# Altium schematic sheet A7_FUNCTION1 -2.SchDoc
size A3
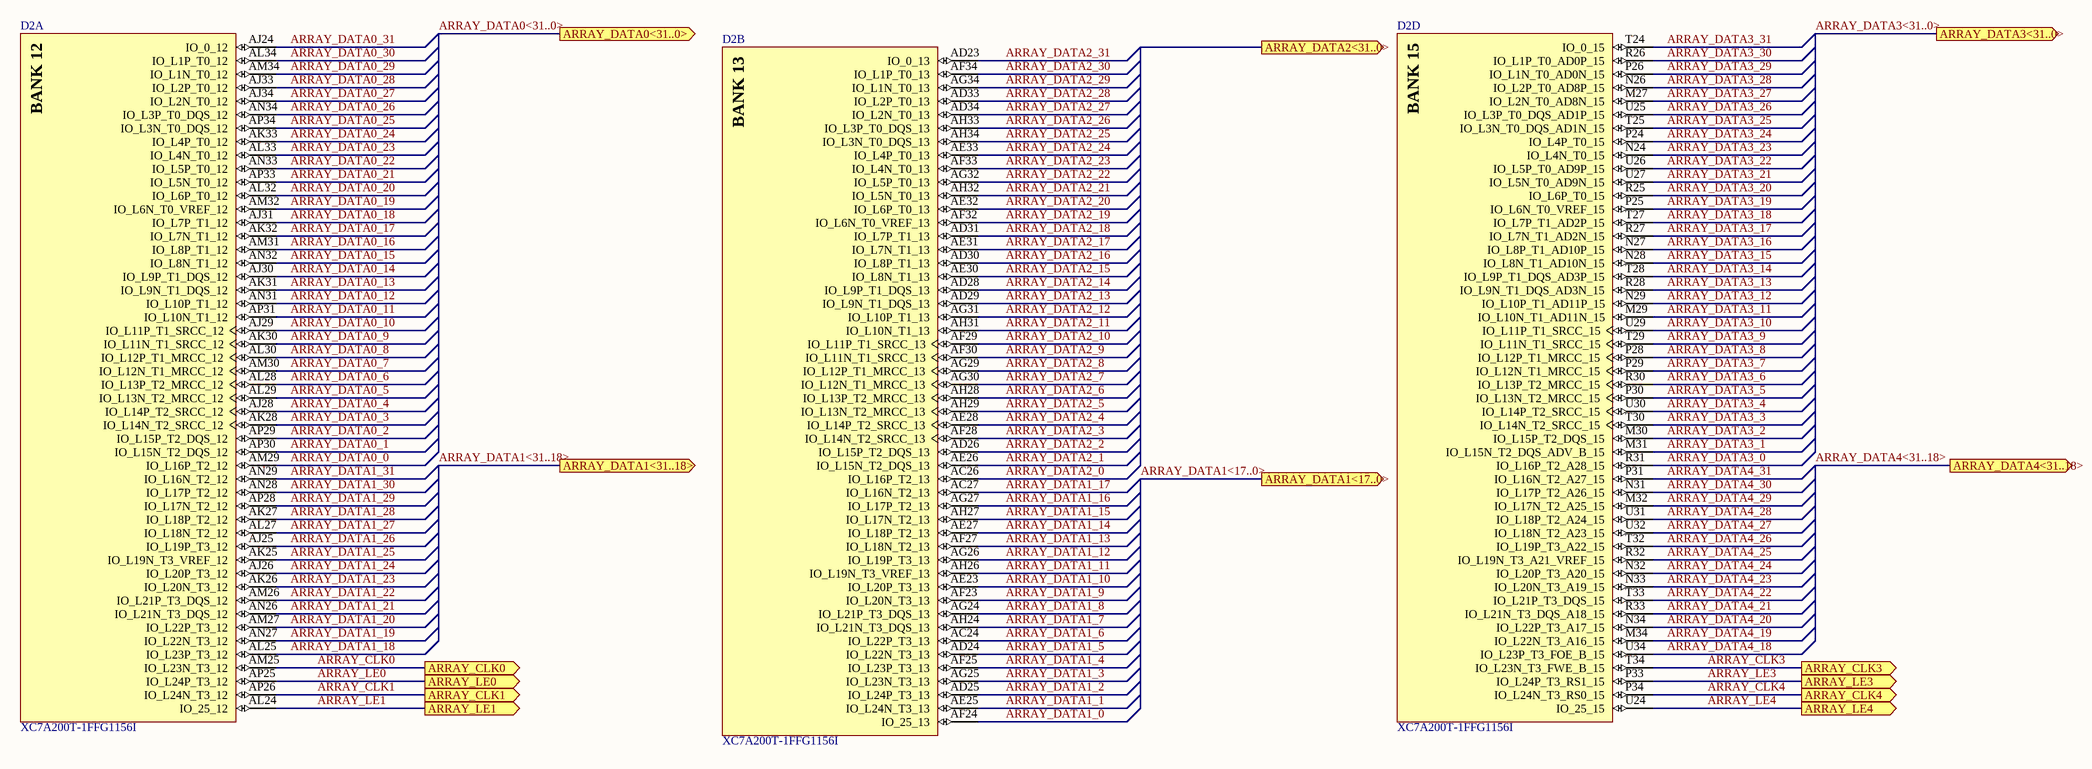
[diagram p0: A7_FUNCTION1 -2.SchDoc]

## Parts
D2  XC7A200T-1FFG1156I  [FFG1156]  (parts A,B,D of 18)

## Ports
ARRAY_CLK0 (out), ARRAY_CLK1 (out), ARRAY_CLK3 (out), ARRAY_CLK4 (out), ARRAY_DATA0<31..0> (out), ARRAY_DATA1<17..0> (out), ARRAY_DATA1<31..18> (out), ARRAY_DATA2<31..0> (out), ARRAY_DATA3<31..0> (out), ARRAY_DATA4<31..18> (out), ARRAY_LE0 (out), ARRAY_LE1 (out), ARRAY_LE3 (out), ARRAY_LE4 (out)

## Nets
ARRAY_CLK0: D2.AM25(IO_L23N_T3_12) ; port ARRAY_CLK0
ARRAY_CLK1: D2.AP26(IO_L24N_T3_12) ; port ARRAY_CLK1
ARRAY_CLK3: D2.T34(IO_L23N_T3_FWE_B_15) ; port ARRAY_CLK3
ARRAY_CLK4: D2.P34(IO_L24N_T3_RS0_15) ; port ARRAY_CLK4
ARRAY_DATA0_0: D2.AM29(IO_L16P_T2_12)
ARRAY_DATA0_1: D2.AP30(IO_L15N_T2_DQS_12)
ARRAY_DATA0_2: D2.AP29(IO_L15P_T2_DQS_12)
ARRAY_DATA0_3: D2.AK28(IO_L14N_T2_SRCC_12)
ARRAY_DATA0_4: D2.AJ28(IO_L14P_T2_SRCC_12)
ARRAY_DATA0_5: D2.AL29(IO_L13N_T2_MRCC_12)
ARRAY_DATA0_6: D2.AL28(IO_L13P_T2_MRCC_12)
ARRAY_DATA0_7: D2.AM30(IO_L12N_T1_MRCC_12)
ARRAY_DATA0_8: D2.AL30(IO_L12P_T1_MRCC_12)
ARRAY_DATA0_9: D2.AK30(IO_L11N_T1_SRCC_12)
ARRAY_DATA0_10: D2.AJ29(IO_L11P_T1_SRCC_12)
ARRAY_DATA0_11: D2.AP31(IO_L10N_T1_12)
ARRAY_DATA0_12: D2.AN31(IO_L10P_T1_12)
ARRAY_DATA0_13: D2.AK31(IO_L9N_T1_DQS_12)
ARRAY_DATA0_14: D2.AJ30(IO_L9P_T1_DQS_12)
ARRAY_DATA0_15: D2.AN32(IO_L8N_T1_12)
ARRAY_DATA0_16: D2.AM31(IO_L8P_T1_12)
ARRAY_DATA0_17: D2.AK32(IO_L7N_T1_12)
ARRAY_DATA0_18: D2.AJ31(IO_L7P_T1_12)
ARRAY_DATA0_19: D2.AM32(IO_L6N_T0_VREF_12)
ARRAY_DATA0_20: D2.AL32(IO_L6P_T0_12)
ARRAY_DATA0_21: D2.AP33(IO_L5N_T0_12)
ARRAY_DATA0_22: D2.AN33(IO_L5P_T0_12)
ARRAY_DATA0_23: D2.AL33(IO_L4N_T0_12)
ARRAY_DATA0_24: D2.AK33(IO_L4P_T0_12)
ARRAY_DATA0_25: D2.AP34(IO_L3N_T0_DQS_12)
ARRAY_DATA0_26: D2.AN34(IO_L3P_T0_DQS_12)
ARRAY_DATA0_27: D2.AJ34(IO_L2N_T0_12)
ARRAY_DATA0_28: D2.AJ33(IO_L2P_T0_12)
ARRAY_DATA0_29: D2.AM34(IO_L1N_T0_12)
ARRAY_DATA0_30: D2.AL34(IO_L1P_T0_12)
ARRAY_DATA0_31: D2.AJ24(IO_0_12)
ARRAY_DATA1_0: D2.AF24(IO_25_13)
ARRAY_DATA1_1: D2.AE25(IO_L24N_T3_13)
ARRAY_DATA1_2: D2.AD25(IO_L24P_T3_13)
ARRAY_DATA1_3: D2.AG25(IO_L23N_T3_13)
ARRAY_DATA1_4: D2.AF25(IO_L23P_T3_13)
ARRAY_DATA1_5: D2.AD24(IO_L22N_T3_13)
ARRAY_DATA1_6: D2.AC24(IO_L22P_T3_13)
ARRAY_DATA1_7: D2.AH24(IO_L21N_T3_DQS_13)
ARRAY_DATA1_8: D2.AG24(IO_L21P_T3_DQS_13)
ARRAY_DATA1_9: D2.AF23(IO_L20N_T3_13)
ARRAY_DATA1_10: D2.AE23(IO_L20P_T3_13)
ARRAY_DATA1_11: D2.AH26(IO_L19N_T3_VREF_13)
ARRAY_DATA1_12: D2.AG26(IO_L19P_T3_13)
ARRAY_DATA1_13: D2.AF27(IO_L18N_T2_13)
ARRAY_DATA1_14: D2.AE27(IO_L18P_T2_13)
ARRAY_DATA1_15: D2.AH27(IO_L17N_T2_13)
ARRAY_DATA1_16: D2.AG27(IO_L17P_T2_13)
ARRAY_DATA1_17: D2.AC27(IO_L16N_T2_13)
ARRAY_DATA1_18: D2.AL25(IO_L23P_T3_12)
ARRAY_DATA1_19: D2.AN27(IO_L22N_T3_12)
ARRAY_DATA1_20: D2.AM27(IO_L22P_T3_12)
ARRAY_DATA1_21: D2.AN26(IO_L21N_T3_DQS_12)
ARRAY_DATA1_22: D2.AM26(IO_L21P_T3_DQS_12)
ARRAY_DATA1_23: D2.AK26(IO_L20N_T3_12)
ARRAY_DATA1_24: D2.AJ26(IO_L20P_T3_12)
ARRAY_DATA1_25: D2.AK25(IO_L19N_T3_VREF_12)
ARRAY_DATA1_26: D2.AJ25(IO_L19P_T3_12)
ARRAY_DATA1_27: D2.AL27(IO_L18N_T2_12)
ARRAY_DATA1_28: D2.AK27(IO_L18P_T2_12)
ARRAY_DATA1_29: D2.AP28(IO_L17N_T2_12)
ARRAY_DATA1_30: D2.AN28(IO_L17P_T2_12)
ARRAY_DATA1_31: D2.AN29(IO_L16N_T2_12)
ARRAY_DATA2_0: D2.AC26(IO_L16P_T2_13)
ARRAY_DATA2_1: D2.AE26(IO_L15N_T2_DQS_13)
ARRAY_DATA2_2: D2.AD26(IO_L15P_T2_DQS_13)
ARRAY_DATA2_3: D2.AF28(IO_L14N_T2_SRCC_13)
ARRAY_DATA2_4: D2.AE28(IO_L14P_T2_SRCC_13)
ARRAY_DATA2_5: D2.AH29(IO_L13N_T2_MRCC_13)
ARRAY_DATA2_6: D2.AH28(IO_L13P_T2_MRCC_13)
ARRAY_DATA2_7: D2.AG30(IO_L12N_T1_MRCC_13)
ARRAY_DATA2_8: D2.AG29(IO_L12P_T1_MRCC_13)
ARRAY_DATA2_9: D2.AF30(IO_L11N_T1_SRCC_13)
ARRAY_DATA2_10: D2.AF29(IO_L11P_T1_SRCC_13)
ARRAY_DATA2_11: D2.AH31(IO_L10N_T1_13)
ARRAY_DATA2_12: D2.AG31(IO_L10P_T1_13)
ARRAY_DATA2_13: D2.AD29(IO_L9N_T1_DQS_13)
ARRAY_DATA2_14: D2.AD28(IO_L9P_T1_DQS_13)
ARRAY_DATA2_15: D2.AE30(IO_L8N_T1_13)
ARRAY_DATA2_16: D2.AD30(IO_L8P_T1_13)
ARRAY_DATA2_17: D2.AE31(IO_L7N_T1_13)
ARRAY_DATA2_18: D2.AD31(IO_L7P_T1_13)
ARRAY_DATA2_19: D2.AF32(IO_L6N_T0_VREF_13)
ARRAY_DATA2_20: D2.AE32(IO_L6P_T0_13)
ARRAY_DATA2_21: D2.AH32(IO_L5N_T0_13)
ARRAY_DATA2_22: D2.AG32(IO_L5P_T0_13)
ARRAY_DATA2_23: D2.AF33(IO_L4N_T0_13)
ARRAY_DATA2_24: D2.AE33(IO_L4P_T0_13)
ARRAY_DATA2_25: D2.AH34(IO_L3N_T0_DQS_13)
ARRAY_DATA2_26: D2.AH33(IO_L3P_T0_DQS_13)
ARRAY_DATA2_27: D2.AD34(IO_L2N_T0_13)
ARRAY_DATA2_28: D2.AD33(IO_L2P_T0_13)
ARRAY_DATA2_29: D2.AG34(IO_L1N_T0_13)
ARRAY_DATA2_30: D2.AF34(IO_L1P_T0_13)
ARRAY_DATA2_31: D2.AD23(IO_0_13)
ARRAY_DATA3_0: D2.R31(IO_L16P_T2_A28_15)
ARRAY_DATA3_1: D2.M31(IO_L15N_T2_DQS_ADV_B_15)
ARRAY_DATA3_2: D2.M30(IO_L15P_T2_DQS_15)
ARRAY_DATA3_3: D2.T30(IO_L14N_T2_SRCC_15)
ARRAY_DATA3_4: D2.U30(IO_L14P_T2_SRCC_15)
ARRAY_DATA3_5: D2.P30(IO_L13N_T2_MRCC_15)
ARRAY_DATA3_6: D2.R30(IO_L13P_T2_MRCC_15)
ARRAY_DATA3_7: D2.P29(IO_L12N_T1_MRCC_15)
ARRAY_DATA3_8: D2.P28(IO_L12P_T1_MRCC_15)
ARRAY_DATA3_9: D2.T29(IO_L11N_T1_SRCC_15)
ARRAY_DATA3_10: D2.U29(IO_L11P_T1_SRCC_15)
ARRAY_DATA3_11: D2.M29(IO_L10N_T1_AD11N_15)
ARRAY_DATA3_12: D2.N29(IO_L10P_T1_AD11P_15)
ARRAY_DATA3_13: D2.R28(IO_L9N_T1_DQS_AD3N_15)
ARRAY_DATA3_14: D2.T28(IO_L9P_T1_DQS_AD3P_15)
ARRAY_DATA3_15: D2.N28(IO_L8N_T1_AD10N_15)
ARRAY_DATA3_16: D2.N27(IO_L8P_T1_AD10P_15)
ARRAY_DATA3_17: D2.R27(IO_L7N_T1_AD2N_15)
ARRAY_DATA3_18: D2.T27(IO_L7P_T1_AD2P_15)
ARRAY_DATA3_19: D2.P25(IO_L6N_T0_VREF_15)
ARRAY_DATA3_20: D2.R25(IO_L6P_T0_15)
ARRAY_DATA3_21: D2.U27(IO_L5N_T0_AD9N_15)
ARRAY_DATA3_22: D2.U26(IO_L5P_T0_AD9P_15)
ARRAY_DATA3_23: D2.N24(IO_L4N_T0_15)
ARRAY_DATA3_24: D2.P24(IO_L4P_T0_15)
ARRAY_DATA3_25: D2.T25(IO_L3N_T0_DQS_AD1N_15)
ARRAY_DATA3_26: D2.U25(IO_L3P_T0_DQS_AD1P_15)
ARRAY_DATA3_27: D2.M27(IO_L2N_T0_AD8N_15)
ARRAY_DATA3_28: D2.N26(IO_L2P_T0_AD8P_15)
ARRAY_DATA3_29: D2.P26(IO_L1N_T0_AD0N_15)
ARRAY_DATA3_30: D2.R26(IO_L1P_T0_AD0P_15)
ARRAY_DATA3_31: D2.T24(IO_0_15)
ARRAY_DATA4_18: D2.U34(IO_L23P_T3_FOE_B_15)
ARRAY_DATA4_19: D2.M34(IO_L22N_T3_A16_15)
ARRAY_DATA4_20: D2.N34(IO_L22P_T3_A17_15)
ARRAY_DATA4_21: D2.R33(IO_L21N_T3_DQS_A18_15)
ARRAY_DATA4_22: D2.T33(IO_L21P_T3_DQS_15)
ARRAY_DATA4_23: D2.N33(IO_L20N_T3_A19_15)
ARRAY_DATA4_24: D2.N32(IO_L20P_T3_A20_15)
ARRAY_DATA4_25: D2.R32(IO_L19N_T3_A21_VREF_15)
ARRAY_DATA4_26: D2.T32(IO_L19P_T3_A22_15)
ARRAY_DATA4_27: D2.U32(IO_L18N_T2_A23_15)
ARRAY_DATA4_28: D2.U31(IO_L18P_T2_A24_15)
ARRAY_DATA4_29: D2.M32(IO_L17N_T2_A25_15)
ARRAY_DATA4_30: D2.N31(IO_L17P_T2_A26_15)
ARRAY_DATA4_31: D2.P31(IO_L16N_T2_A27_15)
ARRAY_LE0: D2.AP25(IO_L24P_T3_12) ; port ARRAY_LE0
ARRAY_LE1: D2.AL24(IO_25_12) ; port ARRAY_LE1
ARRAY_LE3: D2.P33(IO_L24P_T3_RS1_15) ; port ARRAY_LE3
ARRAY_LE4: D2.U24(IO_25_15) ; port ARRAY_LE4

## Buses and harness runs
bus ARRAY_DATA0<31..0> = port ARRAY_DATA0<31..0>
bus ARRAY_DATA1<17..0> = port ARRAY_DATA1<17..0>
bus ARRAY_DATA1<31..18> = port ARRAY_DATA1<31..18>
bus ARRAY_DATA3<31..0> = port ARRAY_DATA3<31..0>
bus ARRAY_DATA4<31..18> = port ARRAY_DATA4<31..18>

## Notes on the sheet
- (in symbol XC7A200T-1FFG1156I, part A) BANK 12
- (in symbol XC7A200T-1FFG1156I, part B) BANK 13
- (in symbol XC7A200T-1FFG1156I, part D) BANK 15

## Library data of the parts
D2 = XC7A200T-1FFG1156I: Artix-7 FPGA, 500 User I/Os, 16 GTP, 1156-Ball BGA, Speed Grade 1, Industrial Grade, Pb-Free; Manufacturer: Xilinx; Block RAM Blocks (18Kb): 730; Block RAM Blocks (36Kb): 365; Block RAM Blocks (Max Kb): 13140; CLBs (Slices): 33650; Clock Mgmt Tiles (CMTs): 10; DSP48E1 Slices: 740; Logic Cells: 215360; Max User I/O: 500; Speed Grade: -1; DatasheetVersion: v1.12; PackageVersion: Rev 1.8; PackageReference: FFG1156; PackageDescription: Flip-Chip BGA, Body 35 x 35 mm, 1.0 mm Pitch; CLBs (Max Distributed RAM Kb): 2888; Generic Part Number: XC7A200T; RoHS: Pb-Free; Mounting Technology: Surface Mount; Code_JEDEC: MS-034-AAR-1; PartNumber: XC7A200T-1FFG1156I; ComponentLink1Description: Datasheet; ComponentLink1URL: http://www.xilinx.com/support/documentation/data_sheets/ds180_7Series_Overview.pdf; ComponentLink2Description: Package Specification; ComponentLink2URL: http://www.xilinx.com/support/documentation/user_guides/ug475_7Series_Pkg_Pinout.pdf; ComponentLink3Description: DC and Switching Characteristics; ComponentLink3URL: http://www.xilinx.com/support/documentation/data_sheets/ds181_Artix_7_Data_Sheet.pdf; ComponentLink4Description: Package File; ComponentLink4URL: http://www.xilinx.com/support/packagefiles/a7packages/xc7a200tfbg676pkg.txt; ComponentLink5Description: Packaging and Pinout; ComponentLink5URL: http://www.xilinx.com/support/documentation/user_guides/ug475_7Series_Pkg_Pinout.pdf